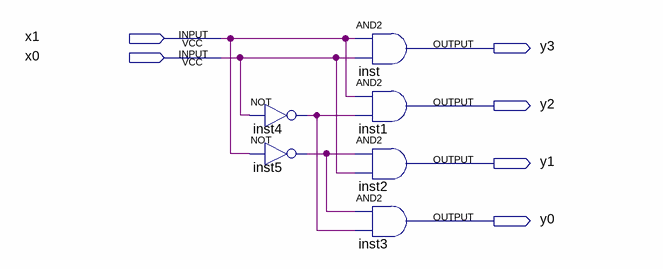
[diagram p0: schematic sheet]
// Quartus schematic DC2-4.bdf as structural Verilog: 6 symbols, 6 pins
module \DC2-4  (
  input  x1,
  input  x0,
  output y3,
  output y2,
  output y1,
  output y0
);

  wire inst4_out, inst5_out;

  not inst4 (inst4_out, x0);
  not inst5 (inst5_out, x1);
  and inst (y3, x1, x0);
  and inst1 (y2, x1, inst4_out);
  and inst2 (y1, inst5_out, x0);
  and inst3 (y0, inst5_out, inst4_out);
endmodule
